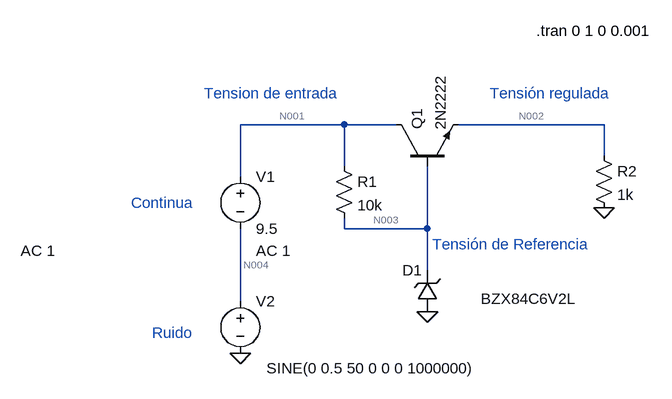
[diagram p0: schematic Regulador_serie_simple.asc]
Regulador_serie_simple.asc, the LTspice schematic file:
Version 4.1
SHEET 1 880 680
WIRE 128 80 -32 80
WIRE 208 80 128 80
WIRE 528 80 304 80
WIRE 528 128 528 80
WIRE 128 144 128 80
WIRE -32 160 -32 80
WIRE 128 240 128 224
WIRE 256 240 256 144
WIRE 256 240 128 240
WIRE 256 304 256 240
WIRE -32 352 -32 240
FLAG 256 368 0
FLAG 528 208 0
FLAG -32 432 0
DATAFLAG 16 80 ""
DATAFLAG 432 80 ""
DATAFLAG 256 240 ""
SYMBOL voltage -32 144 R0
WINDOW 123 24 130 Left 2
WINDOW 39 0 0 Left 0
SYMATTR InstName V1
SYMATTR Value 9.5
SYMATTR Value2 AC 1
SYMBOL npn 208 144 R270
SYMATTR InstName Q1
SYMATTR Value 2N2222
SYMBOL zener 272 368 R180
WINDOW 0 24 64 Left 2
WINDOW 3 -213 20 Left 2
SYMATTR InstName D1
SYMATTR Value BZX84C6V2L
SYMBOL res 112 128 R0
SYMATTR InstName R1
SYMATTR Value 10k
SYMBOL res 512 112 R0
SYMATTR InstName R2
SYMATTR Value 1k
SYMBOL voltage -32 336 R0
WINDOW 3 40 119 Left 2
WINDOW 123 -338 -62 Left 2
WINDOW 39 0 0 Left 0
SYMATTR InstName V2
SYMATTR Value SINE(0 0.5 50 0 0 0 1000000)
SYMATTR Value2 AC 1
TEXT 424 -64 Left 2 !.tran 0 1 0 0.001
TEXT -168 400 Left 2 ;Ruido
TEXT -200 200 Left 2 ;Continua
TEXT -88 32 Left 2 ;Tension de entrada
TEXT 352 32 Left 2 ;Tensión regulada
TEXT 264 264 Left 2 ;Tensión de Referencia

The netlist it stands for:
* Regulador_serie_simple.asc
V1 N001 N004 9.5 AC 1
Q1 N001 N003 N002 0 2N2222
D1 0 N003 BZX84C6V2L
R1 N001 N003 10k
R2 N002 0 1k
V2 N004 0 SINE(0 0.5 50 0 0 0 1000000) AC 1
.model D D
.lib standard.dio
.model NPN NPN
.model PNP PNP
.lib standard.bjt
.tran 0 1 0 0.001
* Ruido
* Continua
* Tension de entrada
* Tensión regulada
* Tensión de Referencia
.backanno
.end

* Results of the author's LTspice run, read from the files saved beside the schematic
* Operating Point, zero values left out:
*   V(n002) = 5.41 V
*   V(n001) = 9.5 V
*   V(n003) = 6.11 V
*   I(V1) = -5.723 mA
*   I(R2) = 5.41 mA
*   I(D1) = -312.5 µA
*   I(V2) = -5.723 mA
*   Ic(Q1) = 5.384 mA
*   Ib(Q1) = 26.49 µA
*   Ie(Q1) = -5.41 mA
*   I(R1) = 339 µA
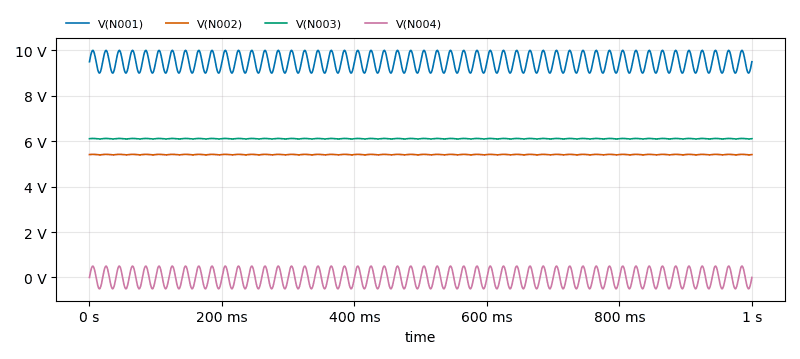
[diagram p1: Transient Analysis of Regulador_serie_simple.asc, plotted from the saved traces]
* Transient Analysis, 1 run:
*   V(N001): min 9 V, max 10 V, average 9.5 V, rms 9.507 V, last 9.5 V
*   V(N002): min 5.397 V, max 5.422 V, average 5.41 V, rms 5.41 V, last 5.41 V
*   V(N003): min 6.097 V, max 6.121 V, average 6.109 V, rms 6.109 V, last 6.11 V
*   V(N004): min -499.6 mV, max 500 mV, average 21.78 µV, rms 354.2 mV, last 0 V